# Altium schematic sheet projet_pcb_etu_formatA3.SchDoc
size A3
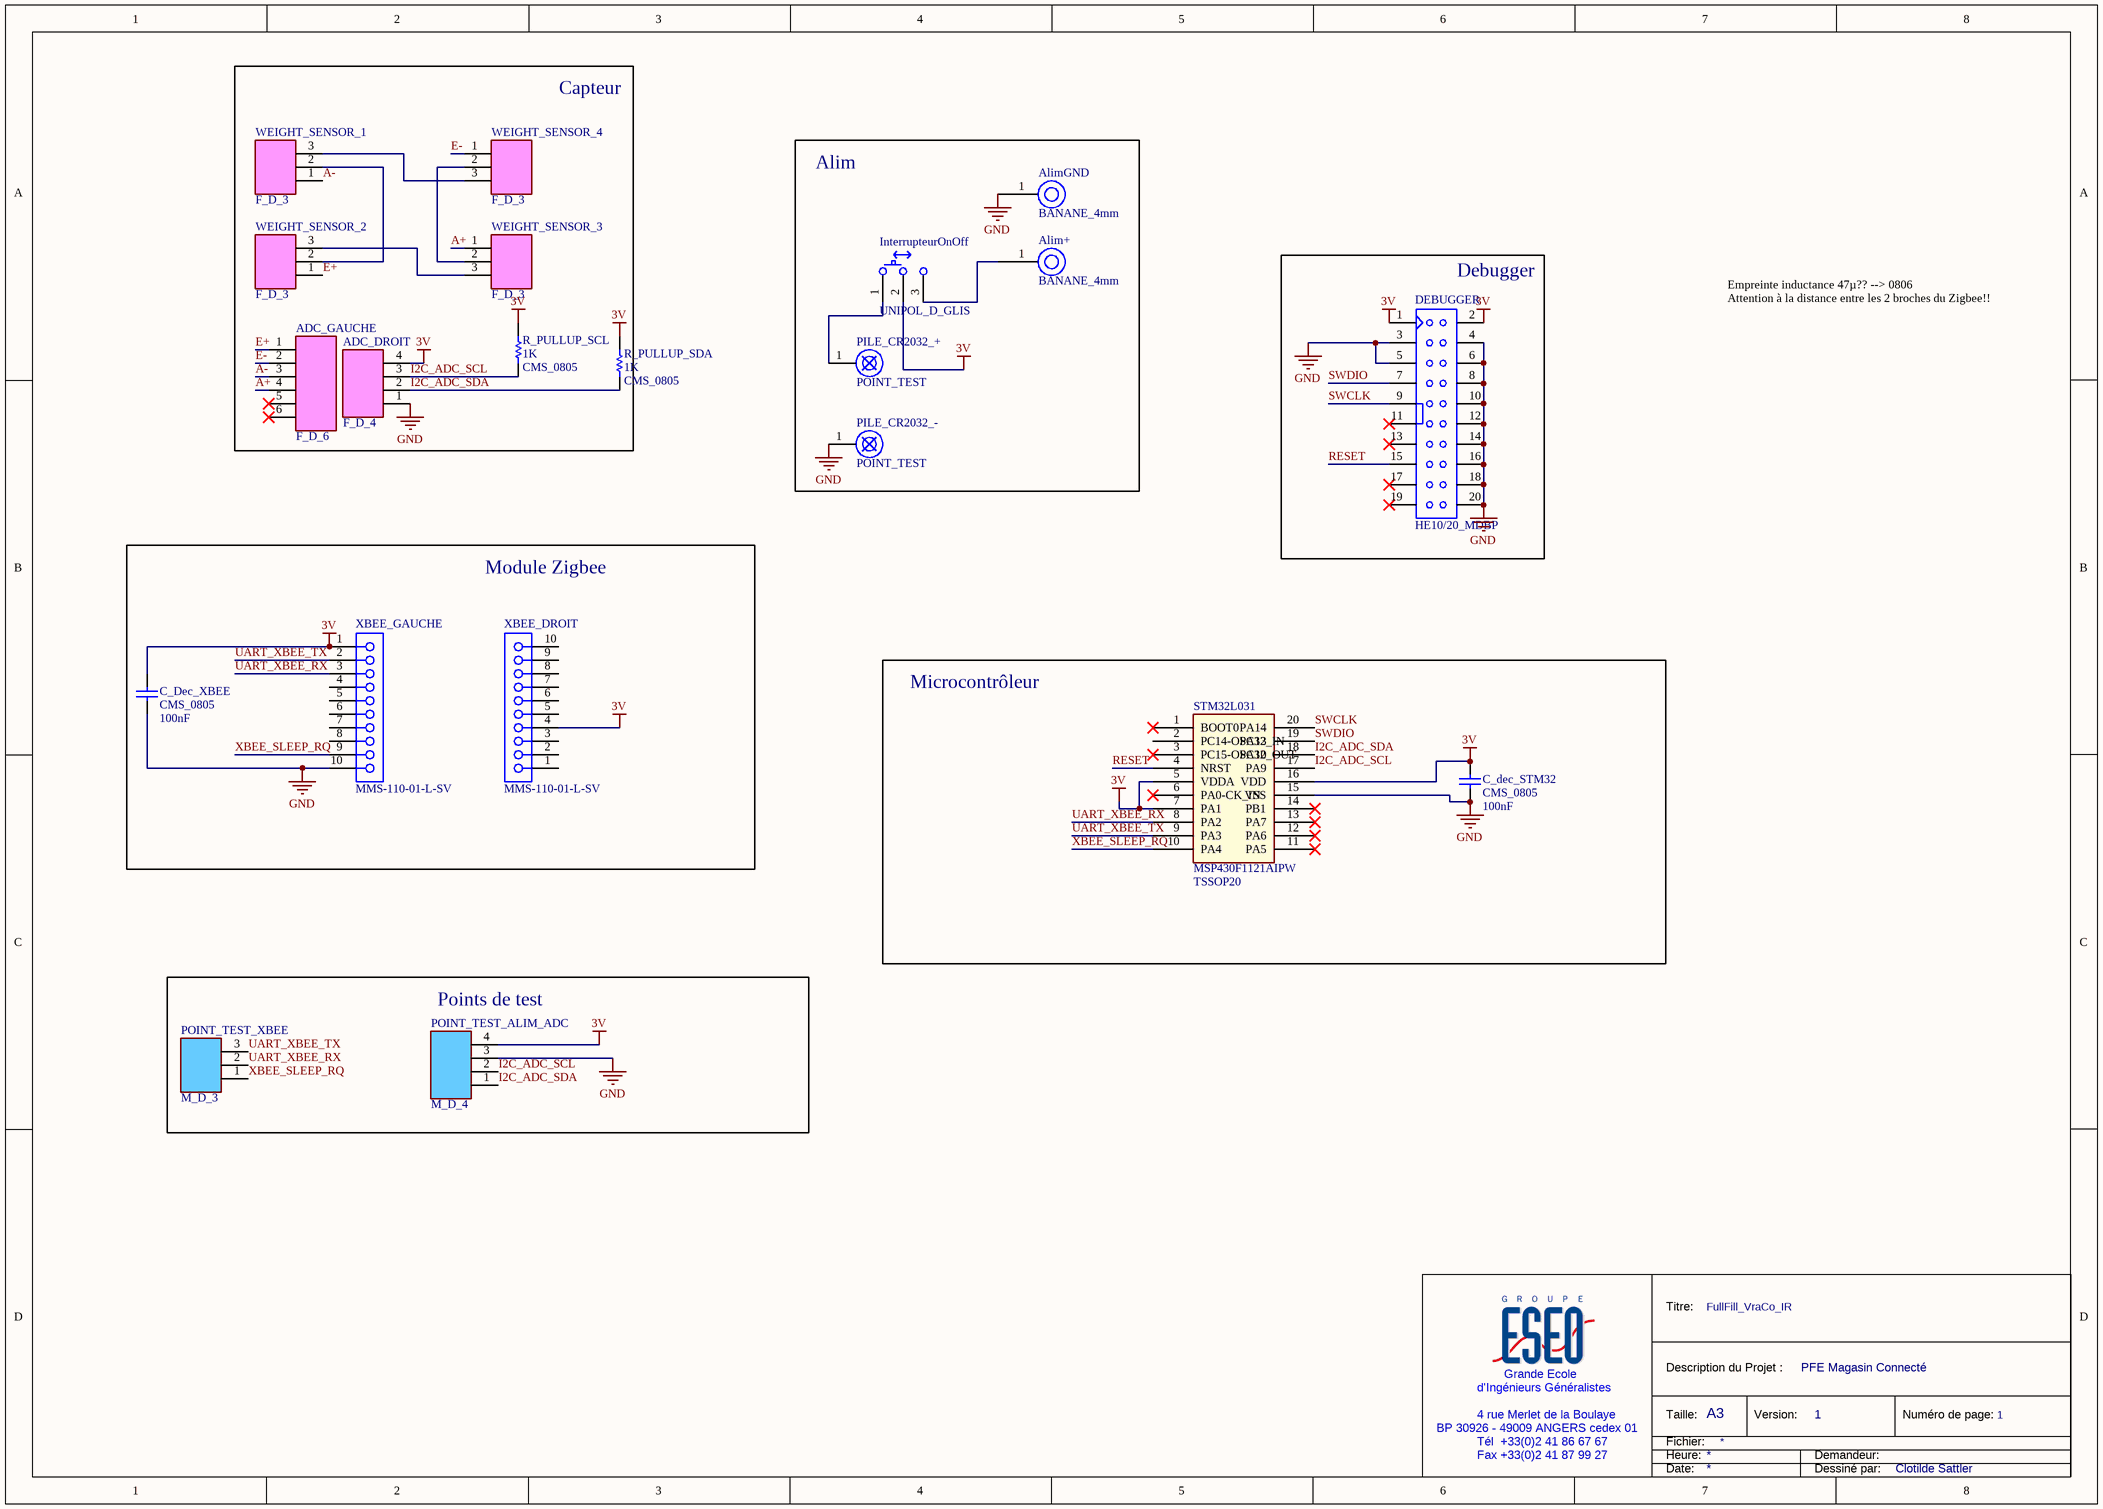
[diagram p0: projet_pcb_etu_formatA3.SchDoc]

## Parts
ADC_DROIT  Type: F_D_4  [BARRETTE_4_F_D]  (hidden comment: BARRETTE_4 CONTACTS_1 RANGEE_FEMELLE_DROITE)
ADC_GAUCHE  Type: F_D_6  [BARRETTE_6_F_D]  (hidden comment: BARRETTE_6 CONTACTS_1 RANGEE_FEMELLE_DROITE)
Alim+  Type: BANANE_4mm  [DOUILLE_BANANE_4mm]  (hidden comment: DOUILLE BANANE 4mm)
AlimGND  Type: BANANE_4mm  [DOUILLE_BANANE_4mm]  (hidden comment: DOUILLE BANANE 4mm)
C_dec_STM32  value 100nF  [CONDENSATEUR_CMS_0805]  (hidden comment: CMS_0805)
C_Dec_XBEE  value 100nF  [CONDENSATEUR_CMS_0805]  (hidden comment: CMS_0805)
DEBUGGER  Type: HE10/20_MDBP  [HE10/20_M_D_BP]  (hidden comment: HE10/20_MALE_DROIT_BAS_PROFIL)
InterrupteurOnOff  Type: UNIPOL_D_GLIS  [INTER_UNIPOL_DROIT_GLISS]  (hidden comment: INTERRUPTEUR_UNIPOLAIRE_DROIT_GLISSIERE)
PILE_CR2032_+  POINT_TEST  [POINT_TEST]
PILE_CR2032_-  POINT_TEST  [POINT_TEST]
POINT_TEST_ALIM_ADC  Type: M_D_4  [BARRETTE_4_M_D]  (hidden comment: BARRETTE_4 CONTACTS_1 RANGEE_MALE_DROITE)
POINT_TEST_XBEE  Type: M_D_3  [BARRETTE_3_M_D]  (hidden comment: BARRETTE 3 CONTACTS 1 RANGEE MALE DROITE)
R_PULLUP_SCL  value 1K  Type: CMS_0805  [RESISTANCE_CMS_0805]  (hidden comment: RESISTANCE_CMS_0805)
R_PULLUP_SDA  value 1K  Type: CMS_0805  [RESISTANCE_CMS_0805]  (hidden comment: RESISTANCE_CMS_0805)
STM32L031  Type: MSP430F1121AIPW  Package: TSSOP20  [TSSOP20_PAS=0.65_LARG=6.4_LONG=6.5]  (hidden comment: MSP430F1121AIPW_TSSOP20)
WEIGHT_SENSOR_1  Type: F_D_3  [BARRETTE_3_F_D]  (hidden comment: BARRETTE 3 CONTACTS 1 RANGEE FEMELLE DROITE)
WEIGHT_SENSOR_2  Type: F_D_3  [BARRETTE_3_F_D]  (hidden comment: BARRETTE 3 CONTACTS 1 RANGEE FEMELLE DROITE)
WEIGHT_SENSOR_3  Type: F_D_3  [BARRETTE_3_F_D]  (hidden comment: BARRETTE 3 CONTACTS 1 RANGEE FEMELLE DROITE)
WEIGHT_SENSOR_4  Type: F_D_3  [BARRETTE_3_F_D]  (hidden comment: BARRETTE 3 CONTACTS 1 RANGEE FEMELLE DROITE)
XBEE_DROIT  MMS-110-01-L-SV  [SMTC-MMS-110-01-X-SV]
XBEE_GAUCHE  MMS-110-01-L-SV  [SMTC-MMS-110-01-X-SV]

## Blocks framed on the sheet
Capteur: ADC_DROIT ADC_GAUCHE R_PULLUP_SCL R_PULLUP_SDA WEIGHT_SENSOR_1-WEIGHT_SENSOR_4
Alim: Alim+ AlimGND InterrupteurOnOff PILE_CR2032_+ PILE_CR2032_-
Debugger: DEBUGGER
Module Zigbee: C_Dec_XBEE XBEE_DROIT XBEE_GAUCHE
Microcontrôleur: C_dec_STM32 STM32L031
Points de test: POINT_TEST_ALIM_ADC POINT_TEST_XBEE

## Nets
3V: ADC_DROIT.4 C_dec_STM32.2 C_Dec_XBEE.2 DEBUGGER.1 DEBUGGER.2 InterrupteurOnOff.2 POINT_TEST_ALIM_ADC.4 R_PULLUP_SCL.2 R_PULLUP_SDA.2 STM32L031.5(VDDA) STM32L031.7(PA1) STM32L031.16(VDD) XBEE_DROIT.4 XBEE_GAUCHE.1
GND: ADC_DROIT.1 AlimGND.1 C_dec_STM32.1 C_Dec_XBEE.1 DEBUGGER.3 DEBUGGER.4 DEBUGGER.5 DEBUGGER.6 DEBUGGER.8 DEBUGGER.10 DEBUGGER.12 DEBUGGER.14 DEBUGGER.16 DEBUGGER.18 DEBUGGER.20 PILE_CR2032_-.1 POINT_TEST_ALIM_ADC.3 STM32L031.15(VSS) XBEE_GAUCHE.10
A+: ADC_GAUCHE.4 WEIGHT_SENSOR_3.1
A-: ADC_GAUCHE.3 WEIGHT_SENSOR_1.1
E+: ADC_GAUCHE.1 WEIGHT_SENSOR_2.1
E-: ADC_GAUCHE.2 WEIGHT_SENSOR_4.1
I2C_ADC_SCL: ADC_DROIT.3 POINT_TEST_ALIM_ADC.2 R_PULLUP_SCL.1 STM32L031.17(PA9)
I2C_ADC_SDA: ADC_DROIT.2 POINT_TEST_ALIM_ADC.1 R_PULLUP_SDA.1 STM32L031.18(PA10)
RESET: DEBUGGER.15 STM32L031.4(NRST)
SWCLK: DEBUGGER.9 STM32L031.20(PA14)
SWDIO: DEBUGGER.7 STM32L031.19(PA13)
UART_XBEE_RX: POINT_TEST_XBEE.2 STM32L031.8(PA2) XBEE_GAUCHE.3
UART_XBEE_TX: POINT_TEST_XBEE.3 STM32L031.9(PA3) XBEE_GAUCHE.2
XBEE_SLEEP_RQ: POINT_TEST_XBEE.1 STM32L031.10(PA4) XBEE_GAUCHE.9
NetAlim+_1: Alim+.1 InterrupteurOnOff.3
NetInterrupteurOnOff_1: InterrupteurOnOff.1 PILE_CR2032_+.1
NetWEIGHT_SENSOR_1_2: WEIGHT_SENSOR_1.2 WEIGHT_SENSOR_2.2
NetWEIGHT_SENSOR_1_3: WEIGHT_SENSOR_1.3 WEIGHT_SENSOR_4.3
NetWEIGHT_SENSOR_2_3: WEIGHT_SENSOR_2.3 WEIGHT_SENSOR_3.3
NetWEIGHT_SENSOR_3_2: WEIGHT_SENSOR_3.2 WEIGHT_SENSOR_4.2

Not connected (* = marked no-connect by the designer): ADC_GAUCHE 5* 6*; DEBUGGER 11* 13* 17* 19*; STM32L031 1(BOOT0)* 2(PC14-OSC32_IN) 3(PC15-OSC32_OUT)* 6(PA0-CK_IN)* 11(PA5)* 12(PA6)* 13(PA7)* 14(PB1)*; XBEE_DROIT 1(11) 2(12) 3(13) 5(15) 6(16) 7(17) 8(18) 9(19) 10(20); XBEE_GAUCHE 4 5 6 7 8

## Notes on the sheet
- Empreinte inductance 47µ?? --> 0806
  Attention à la distance entre les 2 broches du Zigbee!!
- Titre:
- FullFill_VraCo_IR
- d'Ingénieurs Généralistes
- Grande Ecole
- Description du Projet :
- PFE Magasin Connecté
- BP 30926 - 49009 ANGERS cedex 01
- 4 rue Merlet de la Boulaye
- Tél  +33(0)2 41 86 67 67
- Fax +33(0)2 41 87 99 27
- Taille:
- Heure:
- Fichier:
- A3
- Version:
- 1
- Demandeur:
- Numéro de page:
- Date:
- Dessiné par:
- Clotilde Sattler

## Library data of the parts
ADC_DROIT = BARRETTE_4 CONTACTS_1 RANGEE_FEMELLE_DROITE: BARRETTE 4 CONTACTS 1 RANGEE FEMELLE DROITE
ADC_GAUCHE = BARRETTE_6 CONTACTS_1 RANGEE_FEMELLE_DROITE: BARRETTE 6 CONTACTS 1 RANGEE FEMELLE DROITE
Alim+ AlimGND = DOUILLE_BANANE_4mm: DOUILLE BANANE 4 mm
C_dec_STM32 C_Dec_XBEE = CONDENSATEUR_CMS_CER_0805: CONDENSATEUR CMS CERAMIQUE 0805; Type: CMS_0805
DEBUGGER = HE10/20_MALE_DROIT_BAS_PROFIL: EMBASE HE10/20 MALE DROIT BAS PROFIL
InterrupteurOnOff = INTERRUPTEUR_UNIPOLAIRE_DROIT_GLISSIERE: INTERRUPTEUR UNIPOLAIRE DROIT A GLISSIERE
PILE_CR2032_+ PILE_CR2032_- = POINT_TEST: POINT TEST
POINT_TEST_ALIM_ADC = BARRETTE_4 CONTACTS_1 RANGEE_MALE_DROITE: BARRETTE 4 CONTACTS 1 RANGEE MALE DROITE
POINT_TEST_XBEE = BARRETTE_3 CONTACTS_1 RANGEE_MALE_DROITE
R_PULLUP_SCL R_PULLUP_SDA = RESISTANCE_CMS_0805: RESISTANCE CMS 0805
STM32L031 = MSP430F1121AIPW_TSSOP20: MICROCONTROLEUR FLASH - 16BITS - TSSOP20
WEIGHT_SENSOR_1-WEIGHT_SENSOR_4 = BARRETTE_3 CONTACTS_1 RANGEE_FEMELLE_DROITE
XBEE_DROIT XBEE_GAUCHE = MMS-110-01-L-SV: Tiger Claw(TM) Socket Strip, Through-hole, Vertical, -55 to 125 degC, 2 mm Pitch, 10-Pin, Female, RoHS; Manufacturer: Samtec; Pitch: 2 mm; DatasheetVersion: F-214; PackageVersion: AO, 2/1993; PackageReference: MMS-110-01-X-SV; PackageDescription: 2mm Through Hole Box Connector Strip Assembly; Supplier 1: Digi-Key; Supplier Part Number 1: SAM1230-10-ND; Supplier 2: Farnell; Supplier Part Number 2: 1885919; Supplier 3: Newark; Supplier Part Number 3: 41T0710; Supplier 4: Newark; Supplier Part Number 4: 96M0485; Orientation: Vertical; RoHS: True; Temperature Range: -55 to 125 degC; Mounting Technology: Through-hole; PartNumber: MMS-110-01-L-SV; ComponentLink1Description: Manufacturer URL; ComponentLink1URL: http://www.samtec.com; ComponentLink2Description: Datasheet; ComponentLink2URL: http://www.samtec.com/documents/webfiles/pdf/MMS.PDF; ComponentLink3Description: Package Specification; ComponentLink3URL: http://www.samtec.com/documents/webfiles/cpdf/MMS-1XX-01-XXX-XX-XXX-MKT1.pdf